# Altium schematic sheet interface1.SchDoc
size A; SheetNumber: 2; SheetTotal: 8
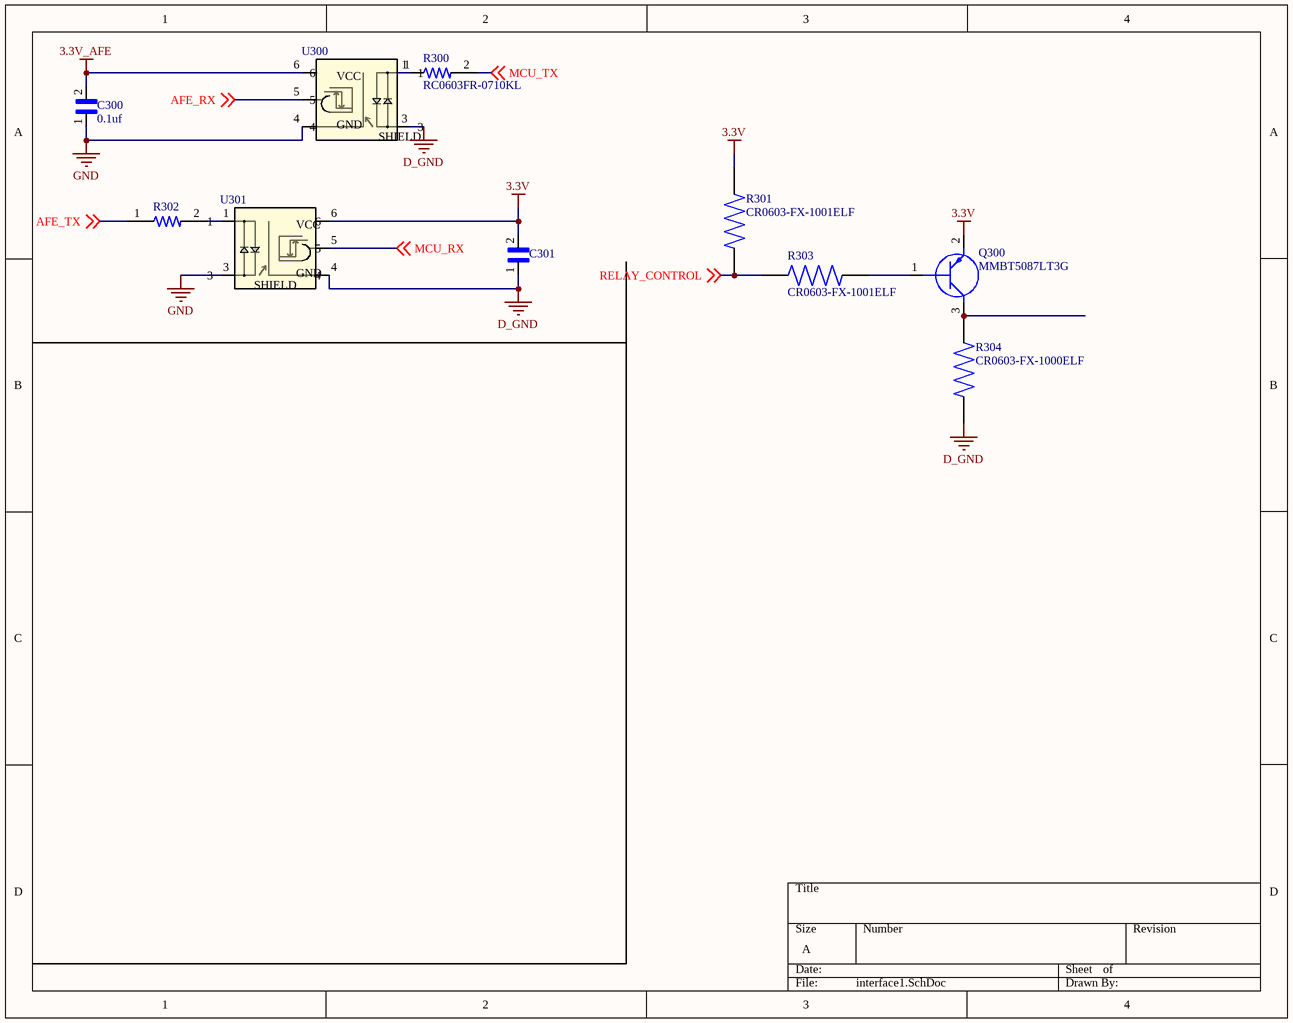
[diagram p0: interface1.SchDoc]

## Parts
C300  value 0.1uf  [CAPC1608X90N]  (hidden comment: 06033G104ZAT4A)
C301  06033G104ZAT4A  [CAPC1608X90N]  (value not drawn)
Q300  MMBT5087LT3G  [SOT96P237X111-3N]
R300  RC0603FR-0710KL  [RESC1607X60N - duplicate]
R301  CR0603-FX-1001ELF  [RESC1608X55N - duplicate]
R302  RC0603FR-0710KL  [RESC1607X60N - duplicate]  (value not drawn)
R303  CR0603-FX-1001ELF  [RESC1608X55N - duplicate]
R304  CR0603-FX-1000ELF  [RESC1608X55N - duplicate]
U300  TLP2395  [5pin SO6_TOS]  (value not drawn)
U301  TLP2395  [5pin SO6_TOS]  (value not drawn)

## Nets
3.3V: C301.2 Q300.2(E) R301.2 U301.6
3.3V_AFE: C300.2 U300.6
D_GND: C301.1 R304.1 U300.3 U301.4
GND: C300.1 U300.4 U301.3
AFE_RX: U300.5 ; off-sheet AFE_RX
AFE_TX: R302.1 ; off-sheet AFE_TX
MCU_RX: U301.5 ; off-sheet MCU_RX
MCU_TX: R300.2 ; off-sheet MCU_TX
RELAY_CONTROL: R301.1 R303.1 ; off-sheet RELAY_CONTROL
NetQ300_1: Q300.1(B) R303.2
NetQ300_3: Q300.3(C) R304.2
NetR300_1: R300.1 U300.1
NetR302_2: R302.2 U301.1

## Notes on the sheet
- (in symbol TLP2395) VCC; GND; SHIELD

## Library data of the parts
C300 C301 = 06033G104ZAT4A: Cap Ceramic 0.1uF 25V Y5V -20% to 80% SMD 0603 85C T/R; MF: {'manufacturer': u'AVX'}; Availability: Unavailable; MP: 06033G104ZAT4A; Price: None; Package: None
  C301: Value: 0.1uf
Q300 = MMBT5087LT3G: Transistor BJT PNP; Manufacturer_Name: onsemi; Datasheet Link: http://www.onsemi.com/pub/Collateral/MMBT5087LT1-D.PDF; Height: 1.11mm; Manufacturer_Part_Number: MMBT5087LT3G; Mouser Part Number: 863-MMBT5087LT3G; Mouser Price/Stock: https://www.mouser.co.uk/ProductDetail/onsemi/MMBT5087LT3G?qs=HVbQlW5zcXXV8WeqAA3nzg%3D%3D; Arrow Part Number: MMBT5087LT3G; Arrow Price/Stock: https://www.arrow.com/en/products/mmbt5087lt3g/on-semiconductor?region=nac
R300 R302 = RC0603FR-0710KL: YAGEO RC0603FR-0710KL / RESISTOR 10K 1/10W 1% 0603 YAG; MF: {'manufacturer': u'Yageo'}; Availability: Unavailable; MP: RC0603FR-0710KL; Price: None; Package: None
  R300: Value: *
  R302: Value: 10k
R301 R303 = CR0603-FX-1001ELF: Resistor; Thick Film; Res 1 Kilohms; Pwr-Rtg 0.1 W; Tol 1%; SMT; 0603; MF: {'manufacturer': u'Bourns'}; Availability: Unavailable; MP: CR0603-FX-1001ELF; Price: None; Package: None; Value: *
R304 = CR0603-FX-1000ELF: SMD 0603 thick film resistor 100R 1%; MF: {'manufacturer': u'Bourns'}; Availability: Unavailable; Price: None; MP: CR0603-FX-1000ELF; Package: None; Value: *
U300 U301 = TLP2395: No Description Available; Mfr_Name: Toshiba Electronic Devices & Storage Corp.; Number_devices_in_Package: 1; Copyright: Copyright (C) 2022 Ultra Librarian. All rights reserved.; Manufacturer_Part_Number: TLP2395; RefDes: RefDes; Type: DEV; Source_Package: TLP2395